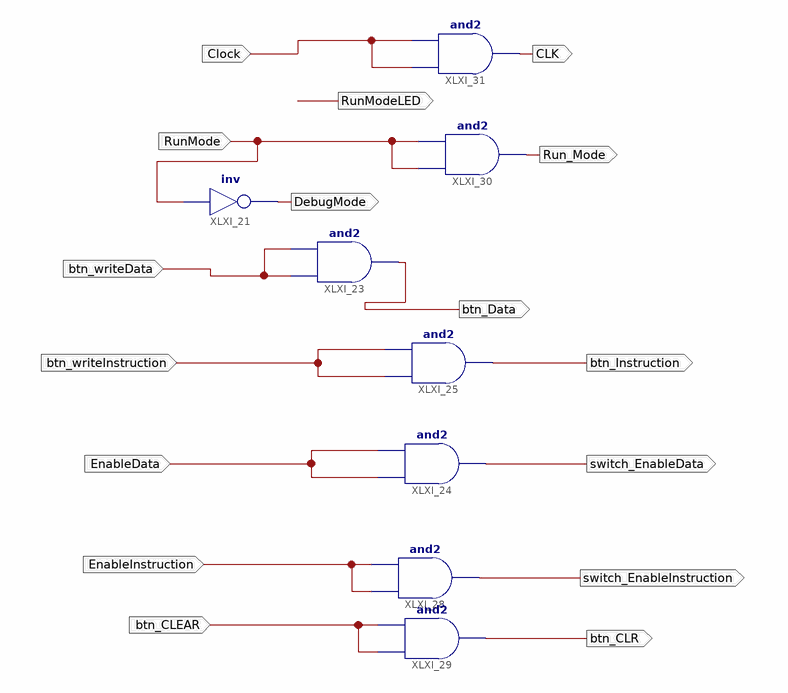
[diagram p0: schematic sheet 1]
// Xilinx ISE schematic Input_Devices.sch (spartan3e) as structural Verilog: 8 symbols, 16 ports
module Input_Devices (
  input  RunMode,
  input  btn_writeData,
  input  btn_writeInstruction,
  input  EnableData,
  input  btn_CLEAR,
  input  EnableInstruction,
  input  Clock,
  output DebugMode,
  output RunModeLED,
  output btn_Data,
  output btn_Instruction,
  output switch_EnableData,
  output switch_EnableInstruction,
  output btn_CLR,
  output CLK,
  output Run_Mode
);

  not XLXI_21 (DebugMode, RunMode);
  and XLXI_23 (btn_Data, btn_writeData, btn_writeData);
  and XLXI_24 (switch_EnableData, EnableData, EnableData);
  and XLXI_25 (btn_Instruction, btn_writeInstruction, btn_writeInstruction);
  and XLXI_28 (switch_EnableInstruction, EnableInstruction, EnableInstruction);
  and XLXI_29 (btn_CLR, btn_CLEAR, btn_CLEAR);
  and XLXI_30 (Run_Mode, RunMode, RunMode);
  and XLXI_31 (CLK, Clock, Clock);
endmodule
